# Altium schematic sheet USB.SchDoc: Motor Vibration
size A4; Organization: NTUST EE-305; Address1: No.43, Sec. 4, Keelung Rd.; Address2: Da’an Dist.; Address3: Taipei 106; Address4: Taiwan (R.O.C.); DocumentNumber: 1; Revision: 3.0; SheetNumber: 6; SheetTotal: 9
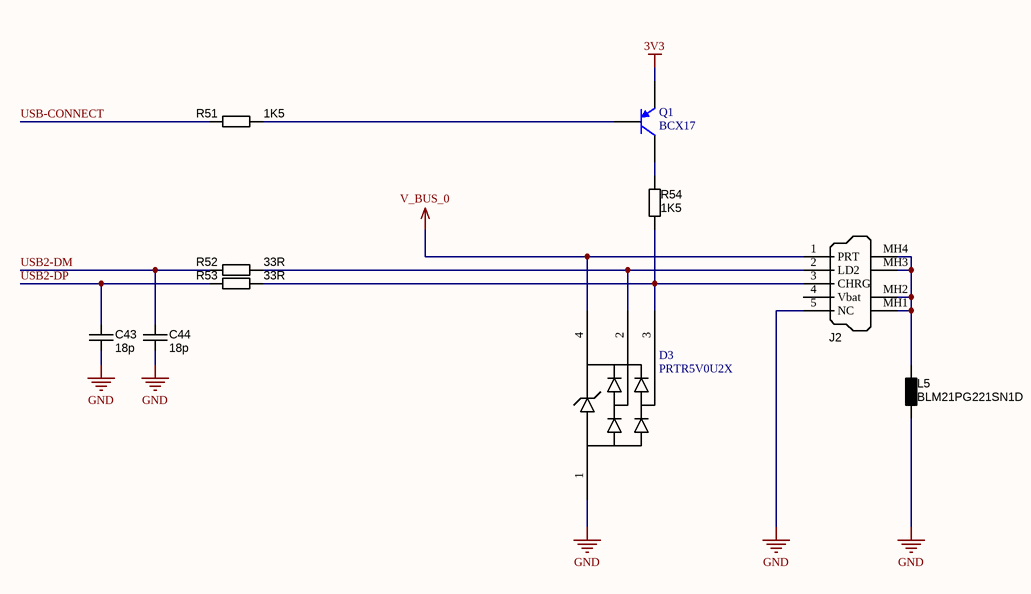
[diagram p0: USB.SchDoc]

## Parts
C43  18p  [CAPC1005N]
C44  18p  [CAPC1005N]
D3  PRTR5V0U2X  [SOT190P230X120-4N]
J2  USB_Micro  [USB_micro]  (value not drawn)
L5  BLM21PG221SN1D  [INDC2012N]
Q1  BCX17  [SOT23-3N]
R51  1K5  [RESC1005N]
R52  33R  [RESC1005N]
R53  33R  [RESC1005N]
R54  1K5  [RESC1005N]

## Nets
3V3: Q1.2(E)
GND: C43.2 C44.2 D3.1(GND) J2.5(NC) L5.1
V_BUS_0: D3.4(VCC) J2.1(PRT)
USB2-DM: C44.1 R52.1
USB2-DP: C43.1 R53.1
USB-CONNECT: R51.1
NetD3_2: D3.2(I/O_1) J2.2(LD2) R52.2
NetD3_3: D3.3(I/O_2) J2.3(CHRG) R53.2 R54.2
NetJ2_MH1: J2.MH1(Shell) J2.MH2(Shell) J2.MH3(Shell) J2.MH4(Shell) L5.2
NetQ1_1: Q1.1(B) R51.2
NetQ1_3: Q1.3(C) R54.1

Not connected (* = marked no-connect by the designer): J2 4(Vbat)

## Notes on the sheet
- Title
- Name
- Size:
- Revision:
- A4
- Date:
- Time:
- Sheet
- of

## Library data of the parts
C43 C44 = Capacitor SMD Cer NPO: Manufacturer 1: Kemet; Manufacturer Part Number 1: C0805C104K5RACTU; Tolerance: ?0%; Ratings: 50V; X7R; Material: ceramic; Package / Case: 0805 (2012 metric); Supplier 1: Digi-Key; Supplier Part Number 1: 399-1170-1-ND; Value: 18p
J2 = USB_Micro: Connector SMD USB Type Micro
L5 = BLM21PG221SN1D: EMIFILr (Inductor type) Chip Ferrite Bead; Supplier 1: Digi-Key; Supplier Part Number 1: 490-1054-1-ND
Q1 = BCX17: PNP General Purpose Transistors; Published: 8-Jun-2000; LatestRevisionDate: 15-Jan-2003; LatestRevisionNote: PCB Footprint 'BCY-W3/D4.7' replaced; DatasheetVersion: 1997; PackageVersion: Sep-1998; PackageReference: TO-92A; Publisher: Altium Limited; PackageDescription: TO, Flat Index; 3 In-Line, Axial Leads; Body Dia. 4.5mm; Leads 0.51 x 0.48 mm (max); ComponentLink1Description: Manufacturer Link; ComponentLink1URL: http://www.fairchildsemi.com/; ComponentLink2Description: Datasheet; ComponentLink2URL: http://www.fairchildsemi.com/ds/2N%2F2N3906.pdf
R51-R54 = Resistor SMD chip: Manufacturer 1: Yageo; Manufacturer Part Number 1: RC0805JR-0710KL; Ratings: 1/8 W; Tolerance: ?%; Package / Case: 0805 (2012 metric); Material: Thick Film; Supplier 1: Digi-Key; Supplier Part Number 1: 311-10KARCT-ND
  R51 R54: Value: 1K5
  R52 R53: Value: 33R